# EAGLE design powerboard (EAGLE 7.1.0)
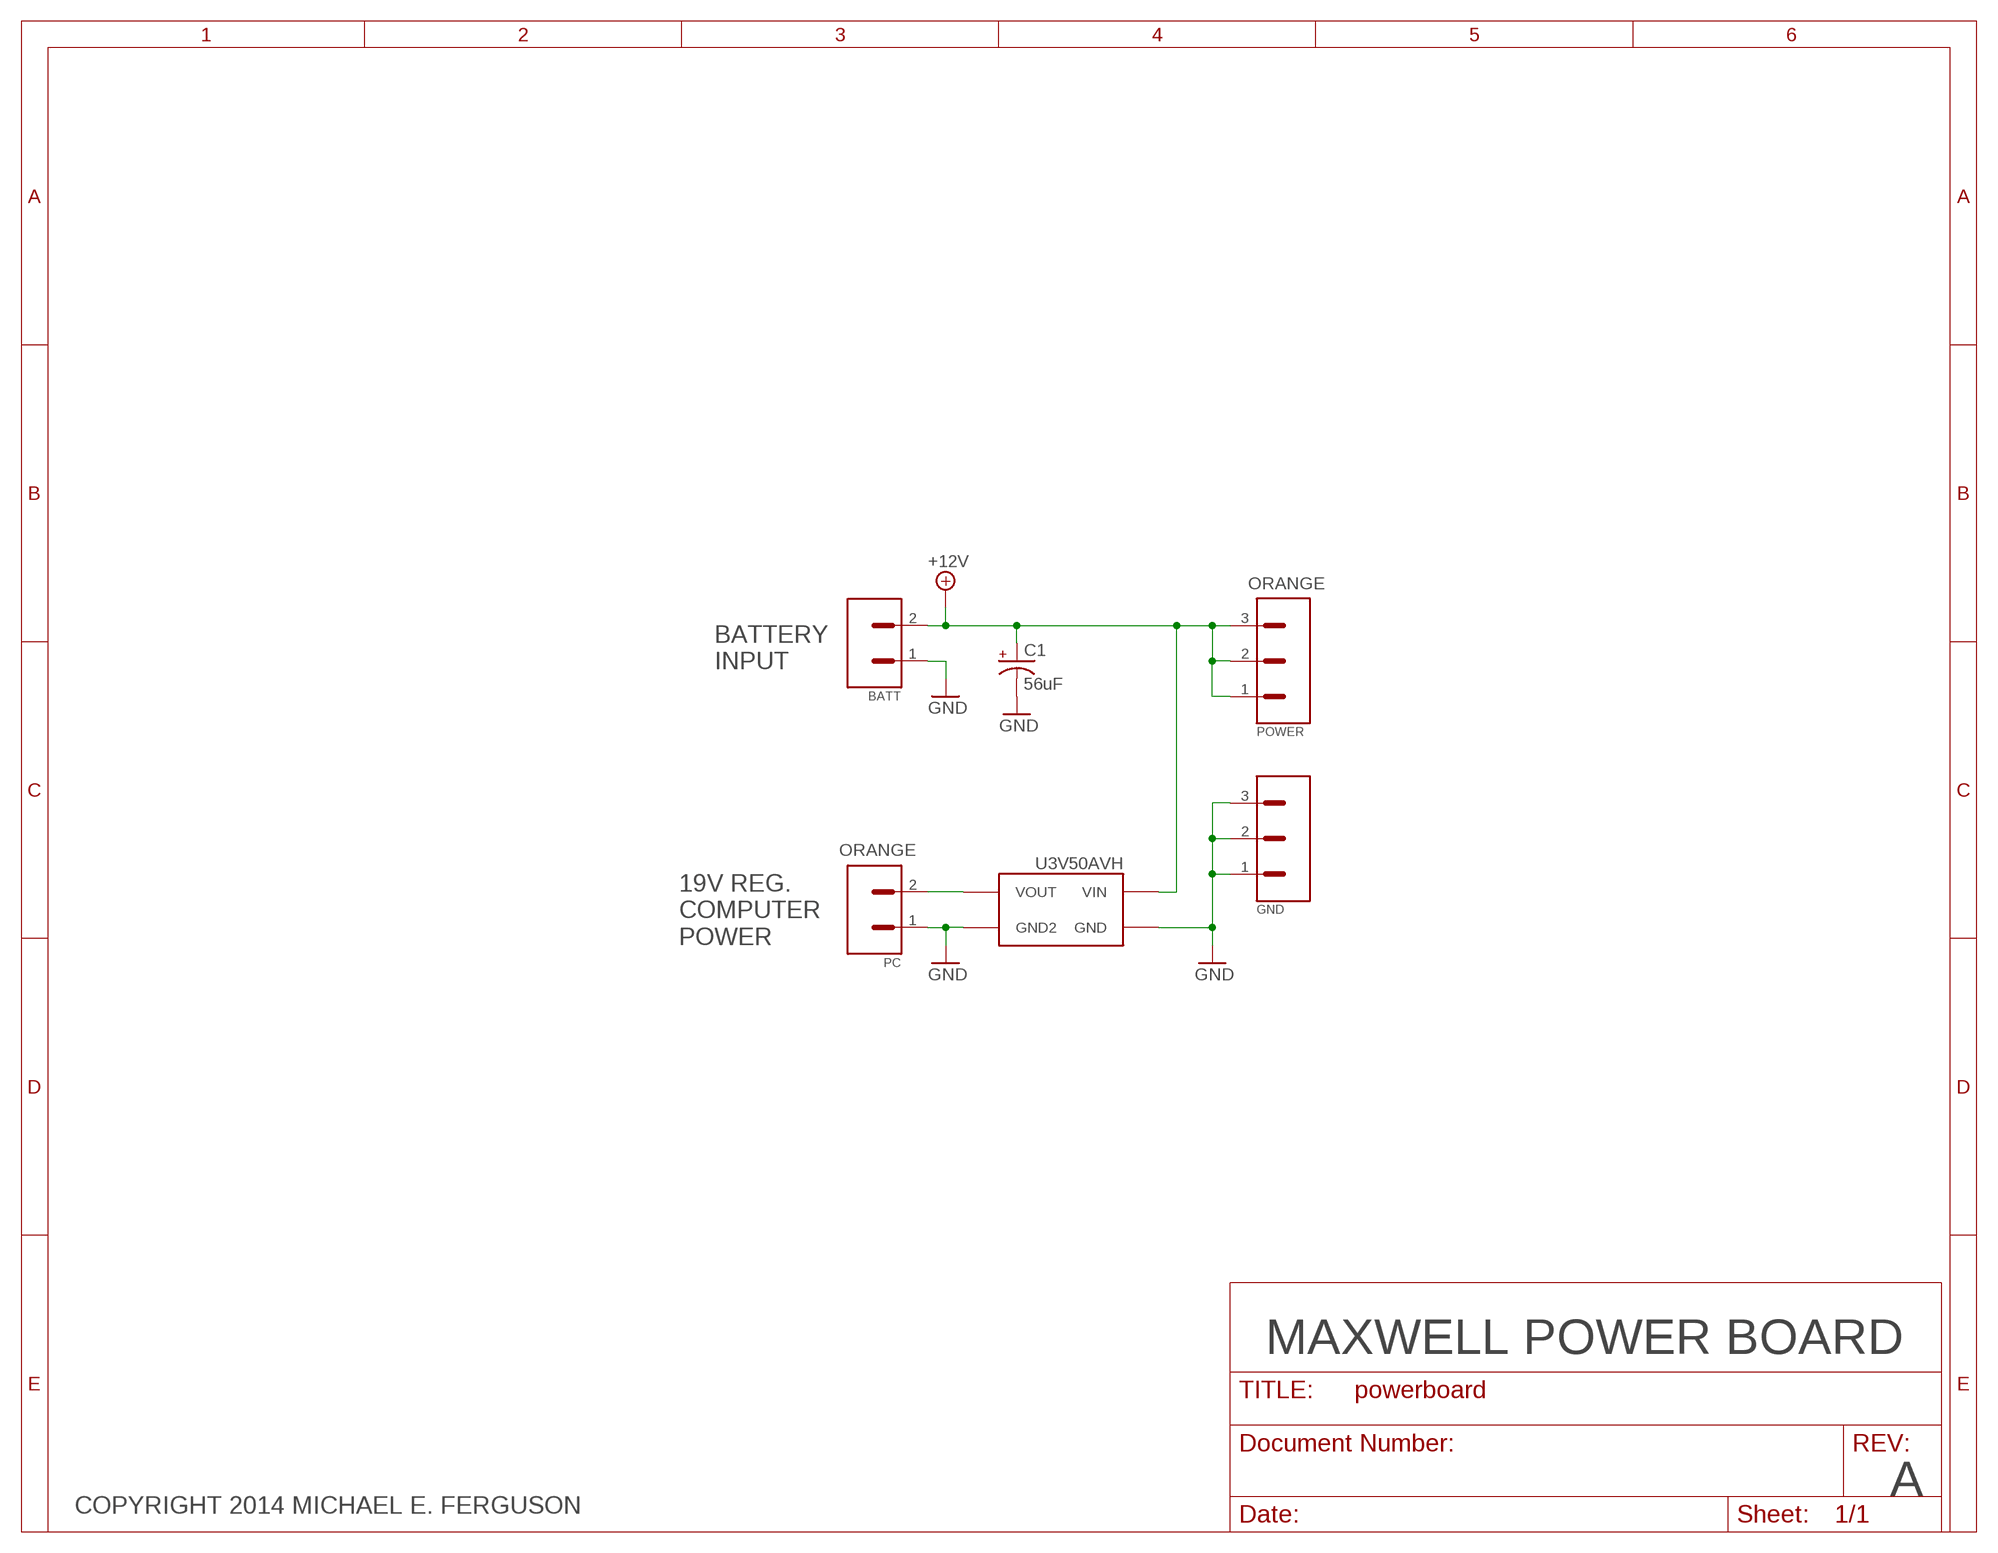
[diagram p0: schematic, sheet 1]

## Parts
BATT  1760510000  [1760490000]
C1  56uF  25SVPF56M  [OSCON_SVPF_6.3MM]
GND  1760520000  [1760520000]
PC  1760490000  [1760490000]
POWER  1760520000  [1760520000]
U3V50AVH  U3V50AHV  [U3V50AHV]

## Nets
+12V: BATT.2 C1.+ POWER.1 POWER.2 POWER.3 U3V50AVH.V_IN(VIN)
GND: BATT.1 C1.- GND.1 GND.2 GND.3 PC.1 U3V50AVH.GND_IN(GND) U3V50AVH.GND_OUT(GND2)
N$1: PC.2 U3V50AVH.V_OUT(VOUT)

## Notes on the sheet
- ORANGE
- BATTERY
  INPUT
- ORANGE
- 19V REG.
  COMPUTER
  POWER
- MAXWELL POWER BOARD
- A
- COPYRIGHT 2014 MICHAEL E. FERGUSON

## Library data of the parts
BATT = headers:1760510000: 15A 2P TERM BLOCK, BLACK tested: NO
C1 = fergs:25SVPF56M: CAP POLYMER 56UF 25V 20% SMD; RIPPLE: 2.8A
GND POWER = headers:1760520000: 15A 3P TERM BLOCK, BLACK tested: NO
PC = headers:1760490000: 15A 2P TERM BLOCK, ORANGE tested: NO
U3V50AVH = pololu:U3V50AHV

## Board
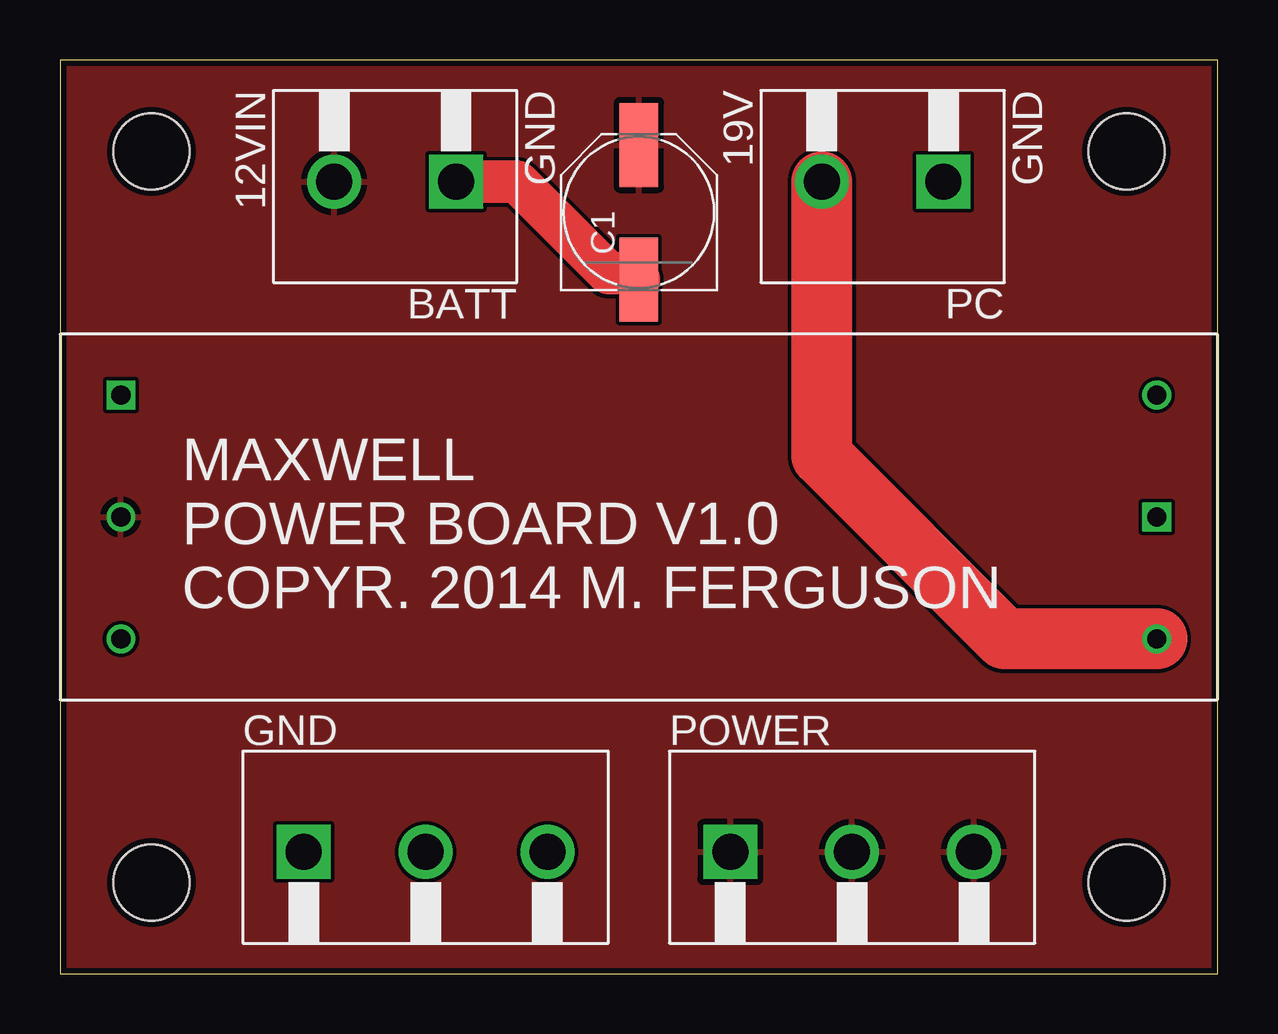
[diagram p1: board, top side]
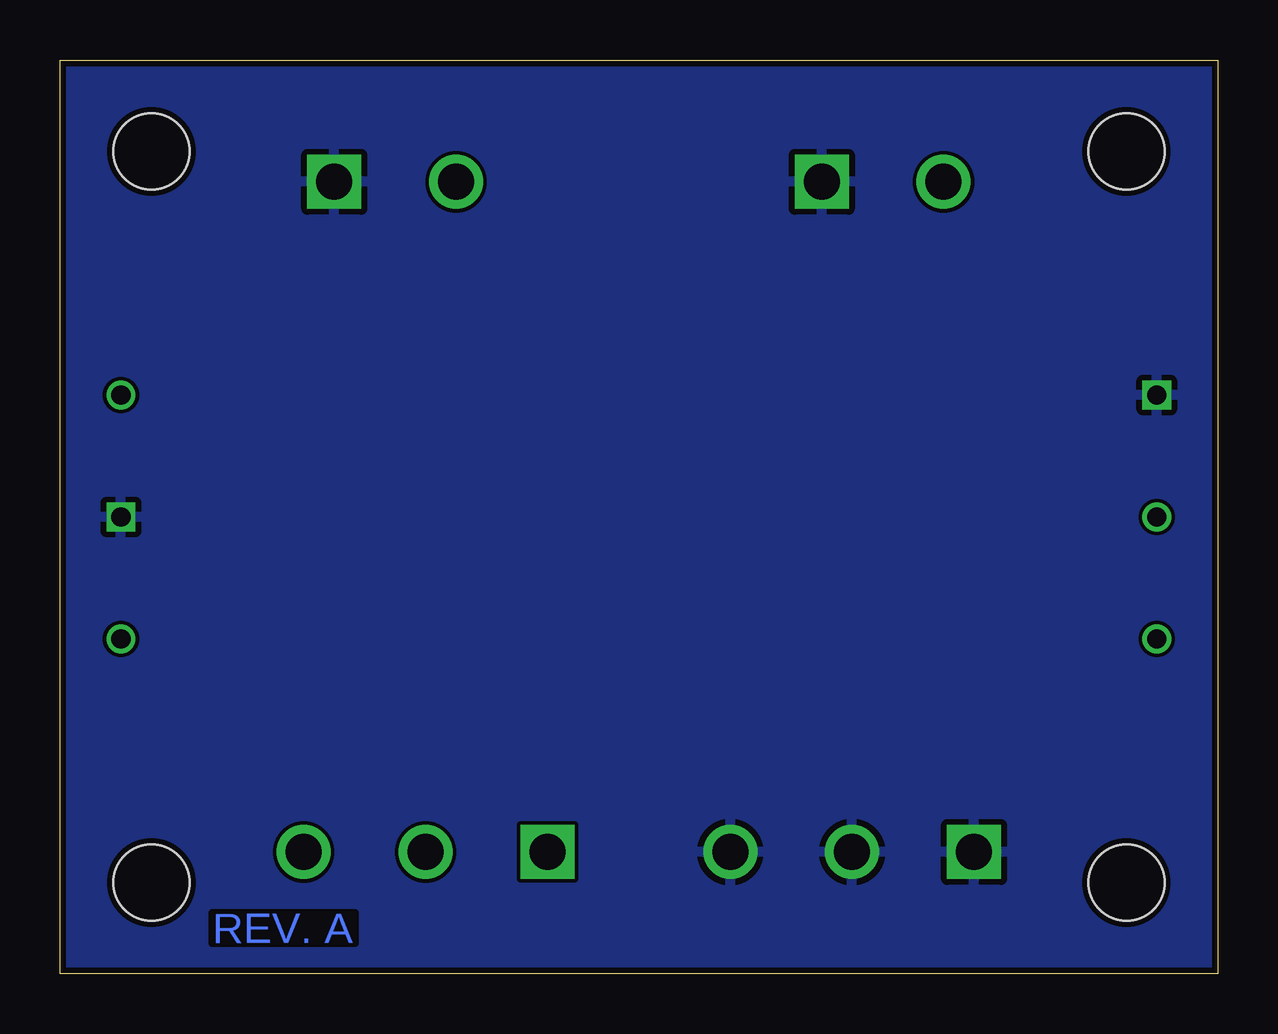
[diagram p2: board, bottom side, seen from below]

Size 48.26 x 38.1 mm. Coordinates in mm from the lower left corner, seen from the top.
Outline: 0,0 48.26,0 48.26,38.1 0,38.1 0,0
Copper layers (1*16): Top 0.035mm / dielectric 0.2mm / Bottom 0.035mm
Design rules "SeeedStudio_DRU_no_angle_20130527": minimum track width 6mil, minimum drill 12mil, track to track 6mil, track to pad 6mil, pad to pad 6mil, via to via 6mil, smd to smd 0mil, copper to edge 10mil, drill to drill 10mil, minimum pad ring 6mil, minimum via ring 6mil, stop-mask expansion 2mil, vias tented up to drill 25mil, thermal gap 10mil
Holes 3.17 mm at 3.81,3.81 44.45,3.81 44.45,34.29 3.81,34.29

### Footprints (pad centres in the part's own frame; a part is rotated, then mirrored left to right if it is on the bottom)
1760490000 = drill 1.5 square: 1 0,0 | drill 1.5: 2 5.08,0
OSCON_SVPF_6.3MM = smd 3.5 x 1.6: + 2.8,0; - -2.8,0
1760520000 = drill 1.5 square: 1 0,0 | drill 1.5: 2 5.08,0; 3 10.16,0
U3V50AHV = drill 0.8: 1 2.54,2.54; 2 45.72,12.7; V_IN 2.54,7.62; V_OUT 45.72,2.54 | drill 0.8 square: GND_IN 2.54,12.7; GND_OUT 45.72,7.62

### Placement (x,y rotation side)
BATT  16.51,33.02 180 top
C1  24.13,31.75 90 top
GND  10.16,5.08 0 top
PC  36.83,33.02 180 top
POWER  27.94,5.08 0 top
U3V50AVH  0,11.43 0 top

### Tracks (layer width: path | path; a pad name or v marks a point on that pad's centre or on a via)
+12V
  pour Top: 0,38.1 48.26,38.1 48.26,0 0,0
GND
  Top 1.778: BATT.1 19.05,33.02 22.86,29.21 23.87,29.21 C1.-
  pour Bottom: 0,38.1 48.26,38.1 48.26,0 0,0
N$1
  Top 2.54: U3V50AVH.V_OUT 39.37,13.97 31.75,21.59 PC.2

### Text on the board
Bottom: REV. A
tPlace: 12VIN | GND | 19V | GND | MAXWELL / POWER BOARD V1.0 / COPYR. 2014 M. FERGUSON